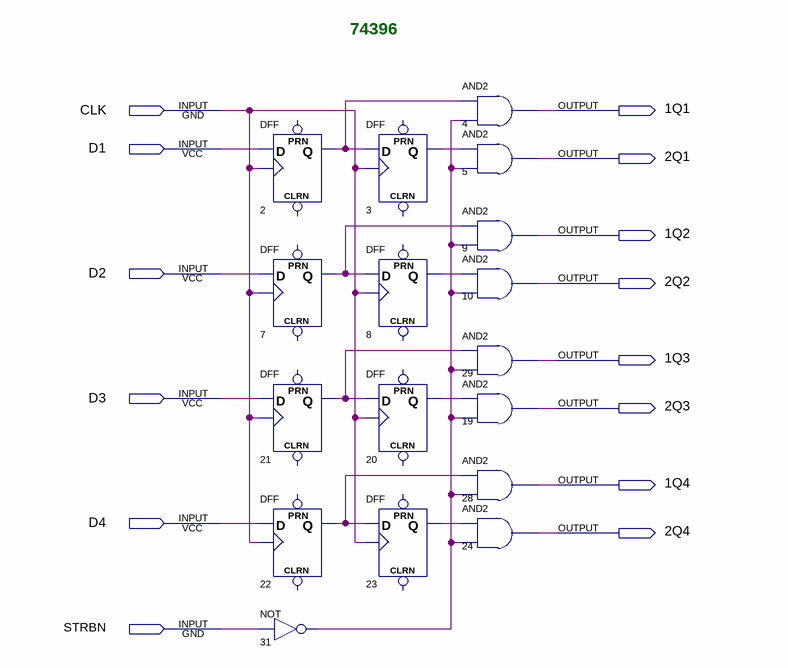
[diagram p0: schematic sheet]
// Quartus schematic 74396.bdf as structural Verilog: 17 symbols, 14 pins
module \74396  (
  input  CLK,
  input  D1,
  input  D2,
  input  D3,
  input  D4,
  input  STRBN,
  output \1Q1 ,
  output \2Q1 ,
  output \1Q2 ,
  output \2Q2 ,
  output \1Q3 ,
  output \2Q3 ,
  output \1Q4 ,
  output \2Q4 
);

  wire n2_q, n3_q, n7_q, n8_q, n20_q, n21_q, n22_q, n23_q, n31_out;

  DFF u_2 (.CLK(CLK), .D(D1), .Q(n2_q));  // open: CLRN, PRN
  DFF u_7 (.CLK(CLK), .D(D2), .Q(n7_q));  // open: CLRN, PRN
  DFF u_21 (.CLK(CLK), .D(D3), .Q(n21_q));  // open: CLRN, PRN
  DFF u_22 (.CLK(CLK), .D(D4), .Q(n22_q));  // open: CLRN, PRN
  not u_31 (n31_out, STRBN);
  DFF u_3 (.CLK(CLK), .D(n2_q), .Q(n3_q));  // open: CLRN, PRN
  DFF u_8 (.CLK(CLK), .D(n7_q), .Q(n8_q));  // open: CLRN, PRN
  DFF u_20 (.CLK(CLK), .D(n21_q), .Q(n20_q));  // open: CLRN, PRN
  DFF u_23 (.CLK(CLK), .D(n22_q), .Q(n23_q));  // open: CLRN, PRN
  and u_4 (\1Q1 , n2_q, n31_out);
  and u_5 (\2Q1 , n3_q, n31_out);
  and u_9 (\1Q2 , n7_q, n31_out);
  and u_10 (\2Q2 , n8_q, n31_out);
  and u_29 (\1Q3 , n21_q, n31_out);
  and u_19 (\2Q3 , n20_q, n31_out);
  and u_28 (\1Q4 , n22_q, n31_out);
  and u_24 (\2Q4 , n23_q, n31_out);

  // Notes on the sheet:
  //   74396
endmodule
